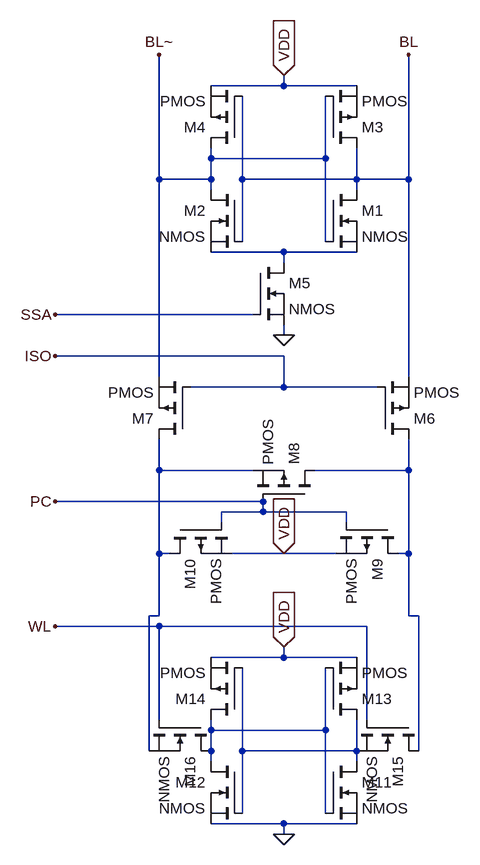
[diagram p0: schematic SRAM1Cell.asc]
SRAM1Cell.asc, the LTspice schematic file:
Version 4
SHEET 1 880 1124
WIRE 32 -48 32 -64
WIRE 32 -48 -80 -48
WIRE 144 -48 32 -48
WIRE -80 64 -80 48
WIRE 96 64 96 -32
WIRE 96 64 -80 64
WIRE -160 96 -160 -96
WIRE -80 96 -80 64
WIRE -80 96 -160 96
WIRE -32 96 -32 -32
WIRE 144 96 144 48
WIRE 144 96 -32 96
WIRE 224 96 224 -96
WIRE 224 96 144 96
WIRE -80 112 -80 96
WIRE 144 112 144 96
WIRE -32 192 -32 96
WIRE 96 192 96 64
WIRE 32 208 -80 208
WIRE 144 208 32 208
WIRE 32 224 32 208
WIRE -16 304 -320 304
WIRE 32 336 32 320
WIRE 32 368 -320 368
WIRE -160 400 -160 96
WIRE 224 400 224 96
WIRE 32 416 32 368
WIRE 32 416 -112 416
WIRE 176 416 32 416
WIRE -160 544 -160 496
WIRE -16 544 -160 544
WIRE 224 544 224 496
WIRE 224 544 80 544
WIRE 0 592 -320 592
WIRE 0 608 0 592
WIRE 0 608 -64 608
WIRE 128 608 0 608
WIRE -64 624 -64 608
WIRE 128 624 128 608
WIRE -160 672 -160 544
WIRE -144 672 -160 672
WIRE 32 672 -48 672
WIRE 112 672 32 672
WIRE 224 672 224 544
WIRE 224 672 208 672
WIRE -160 768 -160 672
WIRE -160 768 -176 768
WIRE 224 768 224 672
WIRE 240 768 224 768
WIRE -160 784 -320 784
WIRE 160 784 -160 784
WIRE 32 832 32 816
WIRE 32 832 -80 832
WIRE 144 832 32 832
WIRE -160 928 -160 784
WIRE 160 928 160 784
WIRE -80 944 -80 928
WIRE 96 944 96 848
WIRE 96 944 -80 944
WIRE -176 976 -176 768
WIRE -80 976 -80 944
WIRE -32 976 -32 848
WIRE 144 976 144 928
WIRE 144 976 -32 976
WIRE 240 976 240 768
WIRE -80 992 -80 976
WIRE 144 992 144 976
WIRE -32 1072 -32 976
WIRE 96 1072 96 944
WIRE 32 1088 -80 1088
WIRE 144 1088 32 1088
WIRE 32 1104 32 1088
FLAG 32 -64 VDD
IOPIN 32 -64 In
FLAG 32 336 0
FLAG 32 672 VDD
IOPIN 32 672 In
FLAG -160 -96 BL~
FLAG 224 -96 BL
FLAG -320 304 SSA
FLAG -320 368 ISO
FLAG -320 592 PC
FLAG 32 816 VDD
IOPIN 32 816 In
FLAG 32 1104 0
FLAG -320 784 WL
SYMBOL nmos 96 112 R0
SYMATTR InstName M1
SYMBOL nmos -32 112 M0
SYMATTR InstName M2
SYMBOL pmos 96 48 M180
SYMATTR InstName M3
SYMBOL pmos -32 48 R180
SYMATTR InstName M4
SYMBOL nmos -16 224 R0
SYMATTR InstName M5
SYMBOL pmos 176 496 M180
SYMATTR InstName M6
SYMBOL pmos -112 496 R180
SYMATTR InstName M7
SYMBOL pmos 80 592 M270
SYMATTR InstName M8
SYMBOL pmos 208 624 R90
SYMATTR InstName M9
SYMBOL pmos -144 624 M90
SYMATTR InstName M10
SYMBOL nmos 96 992 R0
SYMATTR InstName M11
SYMBOL nmos -32 992 M0
SYMATTR InstName M12
SYMBOL pmos 96 928 M180
SYMATTR InstName M13
SYMBOL pmos -32 928 R180
SYMATTR InstName M14
SYMBOL nmos 240 928 R90
SYMATTR InstName M15
SYMBOL nmos -80 928 R90
SYMATTR InstName M16

The netlist it stands for:
* SRAM1Cell.asc
M1 BL BL~ N001 N001 NMOS
M2 BL~ BL N001 N001 NMOS
M3 BL BL~ VDD VDD PMOS
M4 BL~ BL VDD VDD PMOS
M5 N001 SSA 0 0 NMOS
M6 N003 ISO BL BL PMOS
M7 N002 ISO BL~ BL~ PMOS
M8 N003 PC N002 N002 PMOS
M9 N003 PC VDD VDD PMOS
M10 N002 PC VDD VDD PMOS
M11 N005 N004 0 0 NMOS
M12 N004 N005 0 0 NMOS
M13 N005 N004 VDD VDD PMOS
M14 N004 N005 VDD VDD PMOS
M15 N003 WL N005 N005 NMOS
M16 N004 WL N002 N002 NMOS
.model NMOS NMOS
.model PMOS PMOS
.lib standard.mos
.backanno
.end